# EasyEDA Pro project ProPrj_射频OPA695_2025-07-24.epro

# Schematic Schematic1
Board Name: Board1; Create Date: 2025-07-24; Page Name: P1; Project Name: 射频OPA695; Schematic Name: Schematic1; Update Date: 2025-07-24; Company: 嘉立创EDA; Page Size: A4; Version: V1.0
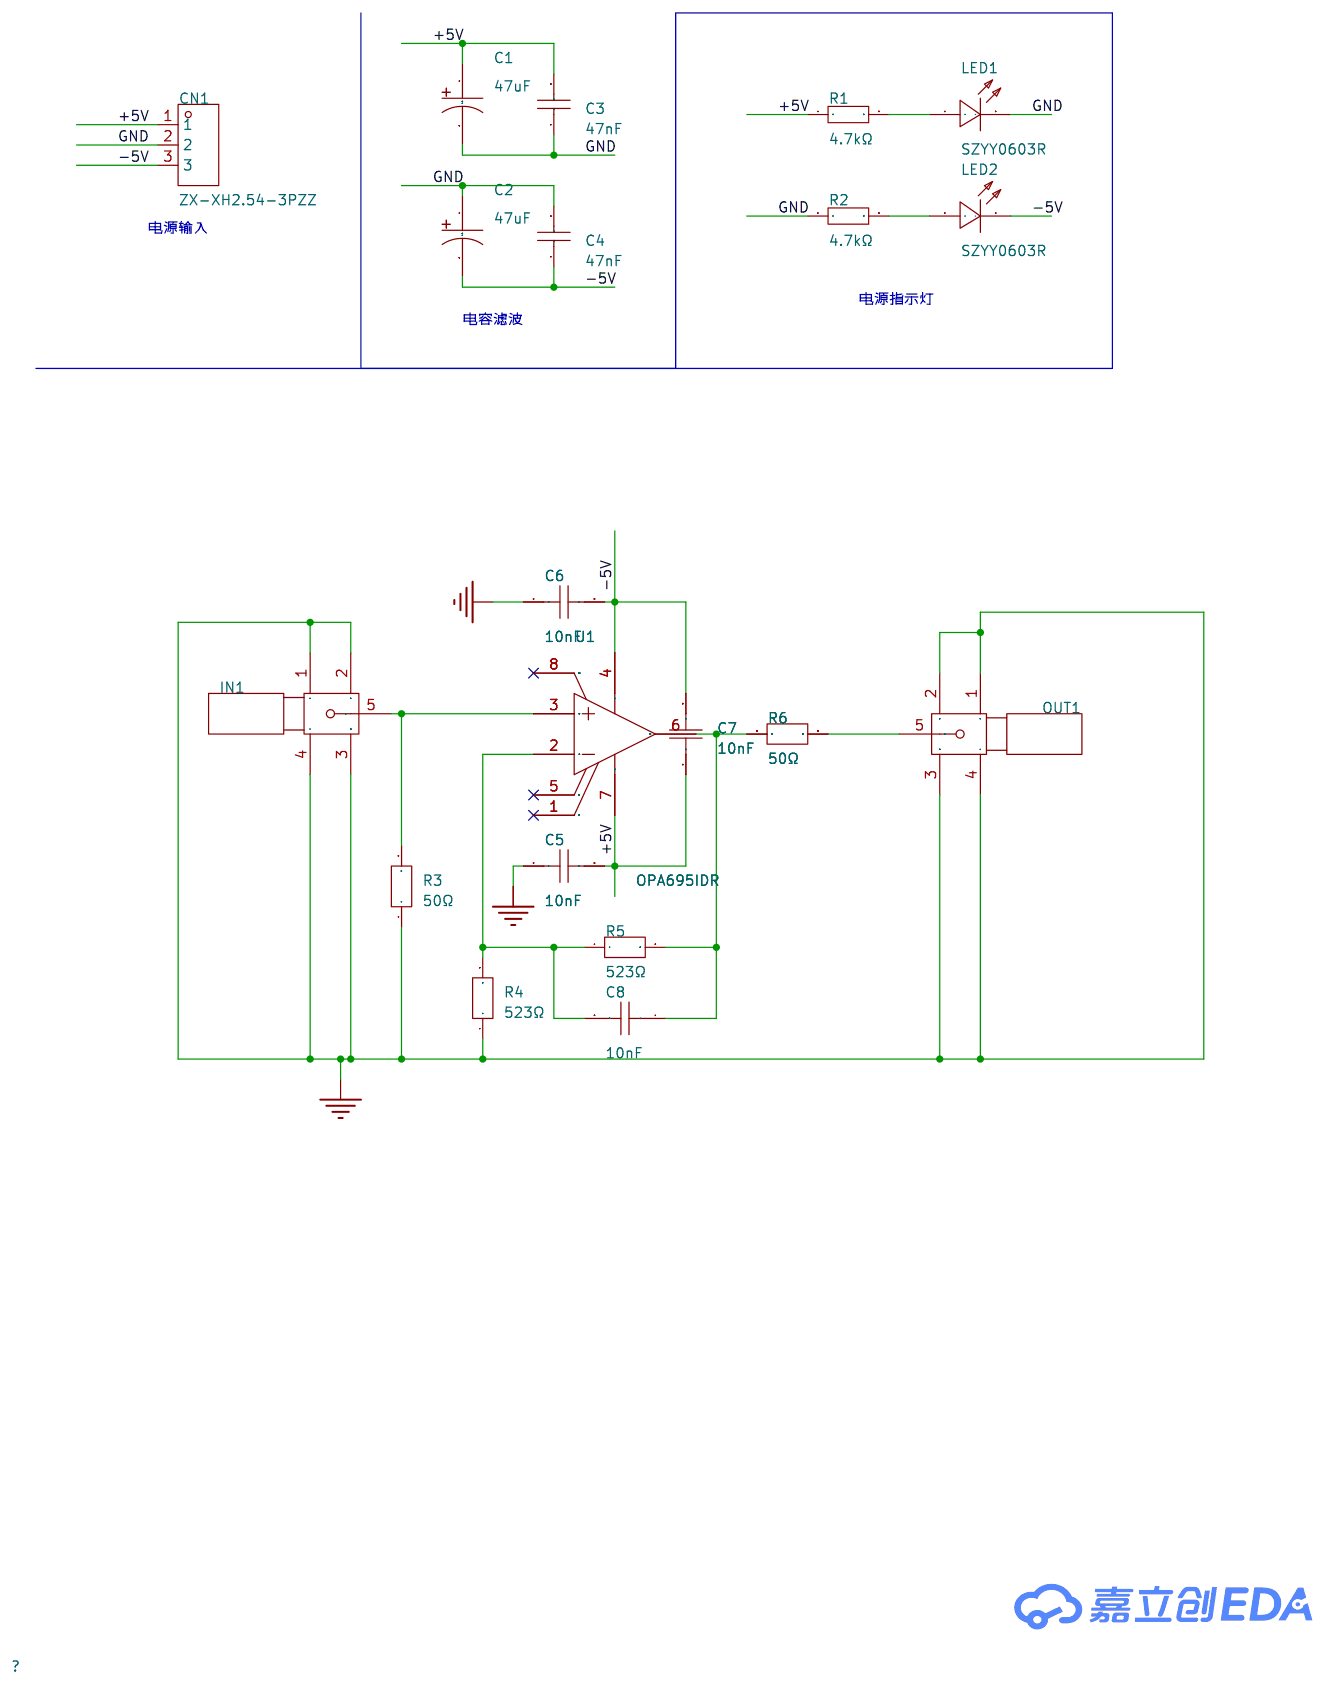
[diagram p0: schematic sheet]

## Parts
C1  47uF  [CAP-TH_BD5.0-P2.00-D0.8-FD]
C2  47uF  [CAP-TH_BD5.0-P2.00-D0.8-FD]
C3  47nF  [C0805]
C4  47nF  [C0805]
C5  10nF  [C0805]
C6  10nF  [C0805]
C7  10nF  [C0805]
C8  10nF  [C0805]
CN1  ZX-XH2.54-3PZZ  [CONN-TH_3P-P2.54_2501S-3P]
IN1  -  [SMA-SMD_BWSMA-KE-P001]
LED1  SZYY0603R  [LED0603-R-RD]
LED2  SZYY0603R  [LED0603-R-RD]
OUT1  -  [SMA-SMD_BWSMA-KE-P001]
R1  4.7kΩ  [R0805]
R2  4.7kΩ  [R0805]
R3  50Ω  [R0805]
R4  523Ω  [R0805]
R5  523Ω  [R0805]
R6  50Ω  [R0805]
U1  OPA695IDR  [SOIC-8_L5.0-W4.0-P1.27-LS6.1-BL]

## Library data of the parts
C1 C2 = NXB25V47M5*11 2.5TP: 容值:47uF;精度:±20%;额定电压:25V;纹波电流:250mA@100kHz;等效串联电阻(ESR):300mΩ@100kHz;; LCSC Part Name: 47uF ±20% 25V; Supplier Part: C371230; Manufacturer: SAMYOUNG(韩国三莹); Supplier Footprint: 插件,D5xL11mm; JLCPCB Part Class: 扩展库; Datasheet: https://atta.szlcsc.com/upload/public/pdf/source/20190227/C371244_FA85FFEFC2961227CF12E3CCE8C34A7D.pdf; Supplier: LCSC; Tolerance: ±20%; Voltage Rating: 25V; Ripple Current: 250mA@100kHz; Equivalent Series Resistance(ESR): 300mΩ@100kHz; Pin Spacing: 2mm; Diameter: 5mm; Height - Seated (Max): 11mm; Lifetime: 2000hrs@105℃; Operating Temperature: -40℃~+105℃
C3 C4 = CL21B473KBCNNNC: 容值:47nF;精度:±10%;额定电压:50V;材质(温度系数):X7R;; LCSC Part Name: 47nF ±10% 50V; Supplier Part: C53134; Manufacturer: SAMSUNG(三星); Supplier Footprint: 0805; JLCPCB Part Class: 基础库; Datasheet: https://atta.szlcsc.com/upload/public/pdf/source/20160218/1457707763339.pdf; Supplier: LCSC; Tolerance: ±10%; Voltage Rated: 50V; Temperature Coefficient: X7R
C5-C8 = CC0805KRX7R9BB103: 容值:10nF;精度:±10%;额定电压:50V;材质(温度系数):X7R;; LCSC Part Name: 10nF ±10% 50V; Supplier Part: C83170; Manufacturer: YAGEO(国巨); Supplier Footprint: 0805; JLCPCB Part Class: 扩展库; Datasheet: https://atta.szlcsc.com/upload/public/pdf/source/20170211/1486785656773.pdf; Supplier: LCSC; Tolerance: ±10%; Voltage Rated: 50V; Temperature Coefficient: X7R
CN1 = ZX-XH2.54-3PZZ: 插针结构:1x3P;间距:2.5mm;安装方式:直插;参考系列:XH;总PIN数:3P;排数:1;每排PIN数:3;行距:-;额定电流:3A;触头材质:黄铜;触头镀层:锡;工作温度范围:-25℃~+85℃;; LCSC Part Name: 1x3P 间距:2.5mm 直插 系列:XH; Supplier Part: C7429633; Manufacturer: Megastar(兆星); Supplier Footprint: 插件,P=2.5mm; JLCPCB Part Class: 扩展库; Datasheet: https://atta.szlcsc.com/upload/public/pdf/source/20230619/AE17037A2CFDBE8D9CBA775D61AD0A84.pdf; Supplier: LCSC; Pins Structure: 1x3P; Pitch: 2.5mm; Mounting Type: 直插; Reference Series: XH; Number of Pins: 3P; Number of Rows: 1; Number of PINs Per Row: 3; Rated Current: 3A; Contact Material: 黄铜; Contact Plating: 锡; Operating Temperature: -25℃~+85℃; Rated Voltage (Max): 250V; Plastic Material: PA66; Flame Retardant Rating: UL94V-0; Color: 白色; Z-Height of the Board: 7mm; X-Length of Bottom Edge on Board (Spacing Line): 10mm; Y-Width of Bottom Edge on Board: 5.9mm
IN1 OUT1 = BWSMA-KE-P001: 连接器类型:板端;接口类型:内孔;端口数量:1;接口直径:5.2mm;接口长度/高度:-;频率:-;射频系列:SMA;阻抗:50Ω;样式:偏脚;工作温度:-;; LCSC Part Name: 内孔 SMA 偏脚; Supplier Part: C496550; Manufacturer: BAT WIRELESS(蝙蝠无线); Supplier Footprint: SMD; JLCPCB Part Class: 扩展库; Datasheet: https://atta.szlcsc.com/upload/public/pdf/source/20240320/28FD502871C976DFF213ABFCF2A0ED51.pdf; Supplier: LCSC; Connector Type: 板端; Interface: 内孔; Number of Ports: 1; Interface Diameter: 5.2mm; RF Series: SMA; Impedance: 50Ω; Style: 偏脚
LED1 LED2 = SZYY0603R: 发光颜色:红色;功率:40mW;正向电流:20mA;主波长:615nm~630nm;二极管配置:-;透镜颜色:无色透明透镜;色温:-;发光角度:120°;载带方式:-;工作温度:-40℃~+85℃;; LCSC Part Name: 红灯; Supplier Part: C434419; Manufacturer: yongyu(永裕光电); Supplier Footprint: 0603; JLCPCB Part Class: 扩展库; Datasheet: https://atta.szlcsc.com/upload/public/pdf/source/20191204/C434419_0B955C1F73FF88449D9A795B6FF49070.pdf; Supplier: LCSC; Emitted Color: 红色; Power Dissipation: 40mW; Forward Current: 20mA; Dominant Wavelength: 615nm~630nm; Peak Wavelength: 645nm; Lens Color: 无色透明透镜; Viewing Angle: 120°; Operating Temperature: -40℃~+85℃
R1 R2 = 0805W8F4701T5E: 电阻类型:厚膜电阻;阻值:4.7kΩ;精度:±1%;功率:125mW;最大工作电压:150V;温度系数:±100ppm/℃;; LCSC Part Name: 4.7kΩ ±1% 125mW 厚膜电阻; Supplier Part: C17673; Manufacturer: UNI-ROYAL(厚声); Supplier Footprint: 0805; JLCPCB Part Class: 基础库; Datasheet: https://atta.szlcsc.com/upload/public/pdf/source/20200306/C422600_1E6D84923E4A46A82E41ADD87F860B5C.pdf; Supplier: LCSC; Type: 厚膜电阻; Tolerance: ±1%; Power(Watts): 125mW; Overload Voltage (Max): 150V; Temperature Coefficient: ±100ppm/℃; Operating Temperature Range: -55℃~+155℃
R3 R6 = ARG05FTC0500: 电阻类型:薄膜电阻;阻值:50Ω;精度:±1%;功率:125mW;最大工作电压:150V;温度系数:±25ppm/℃;; LCSC Part Name: 薄膜电阻 50Ω ±1% 125mW; Supplier Part: C2828866; Manufacturer: Viking(光颉); Supplier Footprint: 0805; JLCPCB Part Class: 扩展库; Datasheet: https://atta.szlcsc.com/upload/public/pdf/source/20211009/C2828883_CAE7D170B8B230FC4A048BDC7B3A81FC.pdf; Supplier: LCSC; Type: 薄膜电阻; Tolerance: ±1%; Power(Watts): 125mW; Overload Voltage (Max): 150V; Temperature Coefficient: ±25ppm/℃; Operating Temperature Range: -55℃~+155℃
R4 R5 = PTFR0805B523RP9: 电阻类型:薄膜电阻;阻值:523Ω;精度:±0.1%;功率:130mW;工作电压:150V;温度系数:±25ppm/℃;; LCSC Part Name: 薄膜电阻 523Ω ±0.1% 130mW; Supplier Part: C2849265; Manufacturer: RESI(开步睿思); Supplier Footprint: 0805; JLCPCB Part Class: 扩展库; Datasheet: https://atta.szlcsc.com/upload/public/pdf/source/20240506/11BDC7478D84177AC2A5326A65B6EB29.pdf; Supplier: LCSC; Type: 薄膜电阻; Tolerance: ±0.1%; Power(Watts): 130mW; Voltage-Supply(Max): 150V; Temperature Coefficient: ±25ppm/℃; Operating Temperature: -55℃~+155℃
U1 = OPA695IDR: 放大器数:单路;增益带宽积(GBP):-;压摆率(SR):4.3V/ns;输入偏置电流(Ib):20uA;; Supplier Part: C1848175; Manufacturer: TI(德州仪器); Supplier Footprint: SOIC-8; JLCPCB Part Class: 扩展库; Datasheet: https://www.ti.com/cn/lit/gpn/opa695; Supplier: LCSC; Number of Channels: 单路; Slew Rate: 4.3V/ns; Ib - Input Bias Current: 20uA; Output Current: 120mA; Operating Temperature: -40℃~+85℃

## Nets
+5V: C1.1 C3.2 C5.2 C7.1 CN1.1 R1.1 U1.7(+VS)
-5V: C2.2 C4.1 C6.2 C7.2 CN1.3 LED2.2(-) U1.4(-VS)
GND: C1.2 C2.1 C3.1 C4.2 C5.1 C6.1 CN1.2 IN1.1 IN1.2 IN1.3 IN1.4 LED1.2(-) OUT1.1 OUT1.2 OUT1.3 OUT1.4 R2.1 R3.1 R4.1
$1N805: LED1.1(+) R1.2
$1N814: LED2.1(+) R2.2
Net-(C8-1): C8.1 R5.2 R6.1 U1.6(Output)
Net-(C8-2): C8.2 R4.2 R5.1 U1.2(-IN)
Net-(IN1-5): IN1.5 R3.2 U1.3(+IN)
Net-(OUT1-5): OUT1.5 R6.2

Not connected (* = marked no-connect by the designer): U1 1(NC)* 5(NC)* 8(DIS#)*

## Notes on the sheet
- 电源输入
- 电源指示灯
- 电容滤波

# Board PCB1
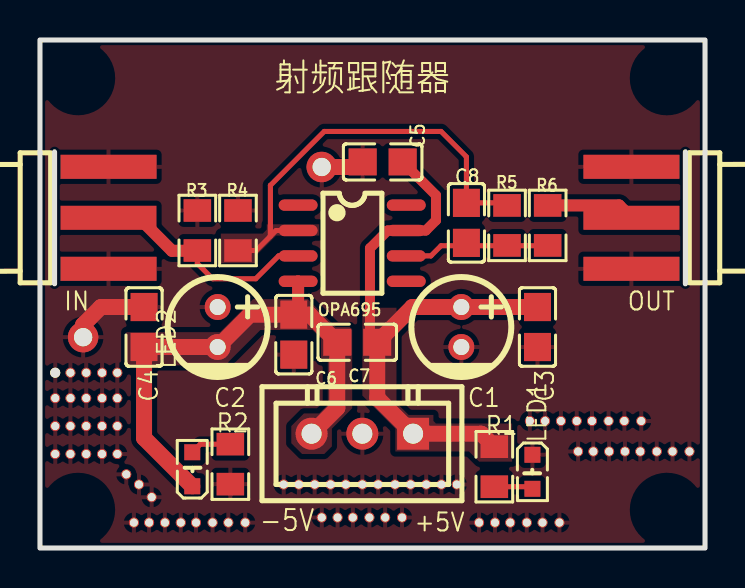
[diagram p1: board, top side]
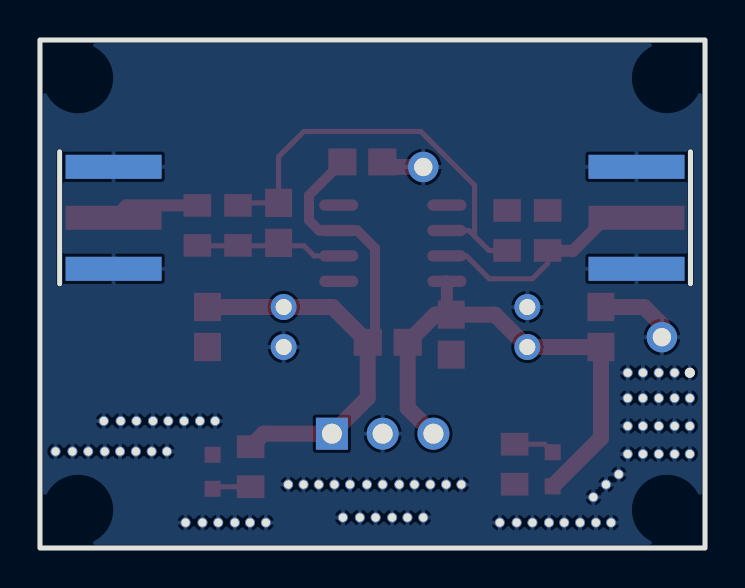
[diagram p2: board, bottom side, seen from below]

Outline 33.27 x 25.4 mm; copper layers: Top Layer, Bottom Layer. Coordinates in mm from the lower left corner of the outline.
Outline path: rectangle 0,25.4 33.27,0
Stack: Top Layer 0.035mm / Dielectric1 1.51mm FR4 er 4.5 / Bottom Layer 0.035mm

## Design rules (mm)
template: JLCPCB Capability(Two Layers Board)
spacing copperThickness1oz (default): track to track 0.102, other pairs 0.152 to 0.3
spacing copperThickness2oz: track to track 0.203, other pairs 0.152 to 0.3
track width copperThickness1oz (default): min 0.127, default 0.254, max 2.54
track width copperThickness2oz: min 0.203, default 0.254, max 2.54
differential pair differentialPair (default): width min 0.127, default 0.254, max 2.54; gap min 0.152, default 0.152
via viaSize (default): diameter min 0.5, default 0.61, max 10; hole min 0.3, default 0.305, max 6.3

## Placement (name value [footprint] x y rotation side)
+5V  ZX-XH2.54-3PZZ  [CONN-TH_3P-P2.54_2501S-3P]  16.13 5.72 180 top
C1  47uF  [CAP-TH_BD5.0-P2.00-D0.8-FD]  21.08 11.05 270 top
C2  47uF  [CAP-TH_BD5.0-P2.00-D0.8-FD]  8.89 11.05 270 top
C3  47nF  [C0805]  24.89 11.05 90 top
C4  47nF  [C0805]  5.21 11.05 90 top
C5  10nF  [C0805]  17.14 19.3 0 top
C6  10nF  [C0805]  12.7 10.67 90 top
C7  10nF  [C0805]  15.88 10.29 180 top
C8  10nF  [C0805]  21.34 16.26 90 top
IN  -  [SMA-SMD_BWSMA-KE-P001]  3.43 16.51 180 top
LED1  SZYY0603R  [LED0603-R-RD]  24.64 3.81 270 top
LED2  SZYY0603R  [LED0603-R-RD]  7.62 3.94 90 top
NOREF  -  [Pad_e430]  29.27 4.83 0 top
NOREF#2  -  [Pad_e456]  22.76 1.27 0 top
NOREF#3  -  [Pad_e433]  31.65 4.83 0 top
NOREF#4  -  [Pad_e446]  16.48 1.52 0 top
NOREF#5  -  [Pad_e338]  2.31 7.49 0 top
NOREF#6  -  [Pad_e386]  17.76 3.17 0 top
NOREF#7  -  [Pad_e428]  27.69 4.83 0 top
NOREF#8  -  [Pad_e340]  3.87 7.49 0 top
NOREF#9  -  [Pad_e447]  17.27 1.52 0 top
NOREF#10  -  [Pad_e349]  3.11 6.1 0 top
NOREF#11  -  [Pad_e460]  25.99 1.27 0 top
NOREF#12  -  [Pad_e382]  14.54 3.17 0 top
NOREF#13  -  [Pad_e458]  24.36 1.27 0 top
NOREF#14  -  [Pad_e358]  6.25 1.27 0 top
NOREF#15  -  [Pad_e408]  28.45 6.35 0 top
NOREF#16  -  [Pad_e351]  0.76 4.7 0 top
NOREF#17  -  [Pad_e427]  26.92 4.83 0 top
NOREF#18  -  [Pad_e317]  1.52 8.76 0 top
NOREF#19  -  [Pad_e404]  25.27 6.35 0 top
NOREF#20  -  [Pad_e434]  32.5 4.83 0 top
NOREF#21  -  [Pad_e339]  3.11 7.49 0 top
NOREF#22  -  [Pad_e347]  1.52 6.1 0 top
NOREF#23  -  [Pad_e374]  10.27 1.27 0 top
NOREF#24  -  [Pad_e319]  3.11 8.76 0 top
NOREF#25  -  [Pad_e353]  2.31 4.7 0 top
NOREF#26  -  [Pad_e357]  5.46 1.27 0 top
NOREF#27  -  [Pad_e448]  18.12 1.52 0 top
NOREF#28  -  [Pad_e410]  30.08 6.35 0 top
NOREF#29  -  [Pad_e383]  15.3 3.17 0 top
NOREF#30  -  [Pad_e436]  19.32 3.17 0 top
NOREF#31  -  [Pad_e337]  1.52 7.49 0 top
NOREF#32  -  [Pad_e372]  8.64 1.27 0 top
NOREF#33  -  [Pad_e336]  0.76 7.49 0 top
NOREF#34  -  [Pad_e444]  14.89 1.52 0 top
NOREF#35  -  [Pad_e366]  4.32 3.68 0 top
NOREF#36  -  [Pad_e373]  9.42 1.27 0 top
NOREF#37  -  [Pad_e405]  26.06 6.35 0 top
NOREF#38  -  [Pad_e316]  0.76 8.76 0 top
NOREF#39  -  [Pad_e104]  2.16 10.54 0 top
NOREF#40  -  [Pad_e459]  25.14 1.27 0 top
NOREF#41  -  [Pad_e360]  7.81 1.27 0 top
NOREF#42  -  [Pad_e355]  3.87 4.7 0 top
NOREF#43  -  [Pad_e437]  20.09 3.17 0 top
NOREF#44  -  [Pad_e455]  21.97 1.27 0 top
NOREF#45  -  [Pad_e435]  18.54 3.17 0 top
NOREF#46  -  [Pad_e407]  27.62 6.35 0 top
NOREF#47  -  [Pad_e438]  20.85 3.17 0 top
NOREF#48  -  [Pad_e457]  23.53 1.27 0 top
NOREF#49  -  [Pad_e348]  2.31 6.1 0 top
NOREF#50  -  [Pad_e403]  24.51 6.35 0 top
NOREF#51  -  [Pad_e385]  16.92 3.17 0 top
NOREF#52  -  [Pad_e381]  13.74 3.17 0 top
NOREF#53  -  [Pad_e320]  3.87 8.76 0 top
NOREF#54  -  [Pad_e431]  30.03 4.83 0 top
NOREF#55  -  [Pad_e409]  29.24 6.35 0 top
NOREF#56  -  [Pad_e445]  15.65 1.52 0 top
NOREF#57  -  [Pad_e356]  4.7 1.27 0 top
NOREF#58  -  [Pad_e359]  7.04 1.27 0 top
NOREF#59  -  [Pad_e429]  28.48 4.83 0 top
NOREF#60  -  [Pad_e380]  12.95 3.17 0 top
NOREF#61  -  [Pad_e432]  30.86 4.83 0 top
NOREF#62  -  [Pad_e379]  12.19 3.17 0 top
NOREF#63  -  [Pad_e318]  2.31 8.76 0 top
NOREF#64  -  [Pad_e384]  16.13 3.17 0 top
NOREF#65  -  [Pad_e212]  14.1 19.05 0 top
NOREF#66  -  [Pad_e354]  3.11 4.7 0 top
NOREF#67  -  [Pad_e367]  4.95 3.17 0 top
NOREF#68  -  [Pad_e443]  14.1 1.52 0 top
NOREF#69  -  [Pad_e350]  3.87 6.1 0 top
NOREF#70  -  [Pad_e406]  26.86 6.35 0 top
NOREF#71  -  [Pad_e346]  0.76 6.1 0 top
NOREF#72  -  [Pad_e352]  1.52 4.7 0 top
NOREF#73  -  [Pad_e368]  5.59 2.54 0 top
OPA695  OPA695IDR  [SOIC-8_L5.0-W4.0-P1.27-LS6.1-BL]  15.62 15.24 270 top
OUT  -  [SMA-SMD_BWSMA-KE-P001]  29.59 16.51 0 top
R1  4.7kΩ  [R0805]  22.73 4.06 270 top
R2  4.7kΩ  [R0805]  9.52 4.19 90 top
R3  50Ω  [R0805]  7.87 15.88 270 top
R4  523Ω  [R0805]  9.91 15.88 270 top
R5  523Ω  [R0805]  23.37 16.13 270 top
R6  50Ω  [R0805]  25.4 16.13 90 top

## Footprints (pads in the part's own frame, mm; a bottom-side part is the same pattern mirrored in y, then rotated)
C0805
  rect 1.41x1.35 smd: 1(-1,0) 2(1,0)
CAP-TH_BD5.0-P2.00-D0.8-FD
  round 1.3 hole 0.8: 1(-1,0) 2(1,0)
CONN-TH_3P-P2.54_2501S-3P
  rect 1.6x1.6 hole 1: 1(-2.54,0)
  round 1.6 hole 1: 2(0,0) 3(2.54,0)
LED0603-R-RD
  rect 0.8x0.8 smd: 1(0.851,0) 2(-0.851,0)
Pad_e104
  round 1.524 hole 0.914: 1(0,0)
Pad_e212
  round 1.524 hole 0.914: 1(0,0)
Pad_e316
  round 0.5 hole 0.914x0.4: 1(0,0)
Pad_e317
  round 0.5 hole 0.4: 1(0,0)
Pad_e318
  round 0.5 hole 0.4: 1(0,0)
Pad_e319
  round 0.5 hole 0.4: 1(0,0)
Pad_e320
  round 0.5 hole 0.4: 1(0,0)
Pad_e336
  round 0.5 hole 0.4: 1(0,0)
Pad_e337
  round 0.5 hole 0.4: 1(0,0)
Pad_e338
  round 0.5 hole 0.4: 1(0,0)
Pad_e339
  round 0.5 hole 0.4: 1(0,0)
Pad_e340
  round 0.5 hole 0.4: 1(0,0)
Pad_e346
  round 0.5 hole 0.4: 1(0,0)
Pad_e347
  round 0.5 hole 0.4: 1(0,0)
Pad_e348
  round 0.5 hole 0.4: 1(0,0)
Pad_e349
  round 0.5 hole 0.4: 1(0,0)
Pad_e350
  round 0.5 hole 0.4: 1(0,0)
Pad_e351
  round 0.5 hole 0.4: 1(0,0)
Pad_e352
  round 0.5 hole 0.4: 1(0,0)
Pad_e353
  round 0.5 hole 0.4: 1(0,0)
Pad_e354
  round 0.5 hole 0.4: 1(0,0)
Pad_e355
  round 0.5 hole 0.4: 1(0,0)
Pad_e356
  round 0.5 hole 0.4: 1(0,0)
Pad_e357
  round 0.5 hole 0.4: 1(0,0)
Pad_e358
  round 0.5 hole 0.4: 1(0,0)
Pad_e359
  round 0.5 hole 0.4: 1(0,0)
Pad_e360
  round 0.5 hole 0.4: 1(0,0)
Pad_e366
  round 0.5 hole 0.4: 1(0,0)
Pad_e367
  round 0.5 hole 0.4: 1(0,0)
Pad_e368
  round 0.5 hole 0.4: 1(0,0)
Pad_e372
  round 0.5 hole 0.4: 1(0,0)
Pad_e373
  round 0.5 hole 0.4: 1(0,0)
Pad_e374
  round 0.5 hole 0.4: 1(0,0)
Pad_e379
  round 0.5 hole 0.4: 1(0,0)
Pad_e380
  round 0.5 hole 0.4: 1(0,0)
Pad_e381
  round 0.5 hole 0.4: 1(0,0)
Pad_e382
  round 0.5 hole 0.4: 1(0,0)
Pad_e383
  round 0.5 hole 0.4: 1(0,0)
Pad_e384
  round 0.5 hole 0.4: 1(0,0)
Pad_e385
  round 0.5 hole 0.4: 1(0,0)
Pad_e386
  round 0.5 hole 0.4: 1(0,0)
Pad_e403
  round 0.5 hole 0.4: 1(0,0)
Pad_e404
  round 0.5 hole 0.4: 1(0,0)
Pad_e405
  round 0.5 hole 0.4: 1(0,0)
Pad_e406
  round 0.5 hole 0.4: 1(0,0)
Pad_e407
  round 0.5 hole 0.4: 1(0,0)
Pad_e408
  round 0.5 hole 0.4: 1(0,0)
Pad_e409
  round 0.5 hole 0.4: 1(0,0)
Pad_e410
  round 0.5 hole 0.4: 1(0,0)
Pad_e427
  round 0.5 hole 0.4: 1(0,0)
Pad_e428
  round 0.5 hole 0.4: 1(0,0)
Pad_e429
  round 0.5 hole 0.4: 1(0,0)
Pad_e430
  round 0.5 hole 0.4: 1(0,0)
Pad_e431
  round 0.5 hole 0.4: 1(0,0)
Pad_e432
  round 0.5 hole 0.4: 1(0,0)
Pad_e433
  round 0.5 hole 0.4: 1(0,0)
Pad_e434
  round 0.5 hole 0.4: 1(0,0)
Pad_e435
  round 0.5 hole 0.4: 1(0,0)
Pad_e436
  round 0.5 hole 0.4: 1(0,0)
Pad_e437
  round 0.5 hole 0.4: 1(0,0)
Pad_e438
  round 0.5 hole 0.4: 1(0,0)
Pad_e443
  round 0.5 hole 0.4: 1(0,0)
Pad_e444
  round 0.5 hole 0.4: 1(0,0)
Pad_e445
  round 0.5 hole 0.4: 1(0,0)
Pad_e446
  round 0.5 hole 0.4: 1(0,0)
Pad_e447
  round 0.5 hole 0.4: 1(0,0)
Pad_e448
  round 0.5 hole 0.4: 1(0,0)
Pad_e455
  round 0.5 hole 0.4: 1(0,0)
Pad_e456
  round 0.5 hole 0.4: 1(0,0)
Pad_e457
  round 0.5 hole 0.4: 1(0,0)
Pad_e458
  round 0.5 hole 0.4: 1(0,0)
Pad_e459
  round 0.5 hole 0.4: 1(0,0)
Pad_e460
  round 0.5 hole 0.4: 1(0,0)
R0805
  rect 1.133x1.377 smd: 1(-1,0) 2(1,0)
SMA-SMD_BWSMA-KE-P001
  rect 4.8x1.2 smd: 1(0,-2.55) 2(0,2.55) 5(0,0)
  rect 4.8x1.2 smd far side: 3(0,2.55) 4(0,-2.55)
SOIC-8_L5.0-W4.0-P1.27-LS6.1-BL
  oval 0.569x1.95 smd: 1(-1.905,-2.705) 2(-0.635,-2.705) 3(0.635,-2.705) 4(1.905,-2.705) 5(1.905,2.705) 6(0.635,2.705) 7(-0.635,2.705) 8(-1.905,2.705)

## Nets
+5V: +5V.1 C1.1 C3.2 C5.2 C7.1 OPA695.7 R1.1
-5V: +5V.3 C2.2 C4.1 C6.2 C7.2 LED2.2 OPA695.4
GND: +5V.2 C1.2 C2.1 C3.1 C4.2 C5.1 C6.1 IN.1 IN.2 IN.3 IN.4 LED1.2 NOREF.1 NOREF#2.1 NOREF#3.1 NOREF#4.1 NOREF#5.1 NOREF#6.1 NOREF#7.1 NOREF#8.1 NOREF#9.1 NOREF#10.1 NOREF#11.1 NOREF#12.1 NOREF#13.1 NOREF#14.1 NOREF#15.1 NOREF#16.1 NOREF#17.1 NOREF#18.1 NOREF#19.1 NOREF#20.1 NOREF#21.1 NOREF#22.1 NOREF#23.1 NOREF#24.1 NOREF#25.1 NOREF#26.1 NOREF#27.1 NOREF#28.1 NOREF#29.1 NOREF#30.1 NOREF#31.1 NOREF#32.1 NOREF#33.1 NOREF#34.1 NOREF#35.1 NOREF#36.1 NOREF#37.1 NOREF#38.1 NOREF#39.1 NOREF#40.1 NOREF#41.1 NOREF#42.1 NOREF#43.1 NOREF#44.1 NOREF#45.1 NOREF#46.1 NOREF#47.1 NOREF#48.1 NOREF#49.1 NOREF#50.1 NOREF#51.1 NOREF#52.1 NOREF#53.1 NOREF#54.1 NOREF#55.1 NOREF#56.1 NOREF#57.1 NOREF#58.1 NOREF#59.1 NOREF#60.1 NOREF#61.1 NOREF#62.1 NOREF#63.1 NOREF#64.1 NOREF#65.1 NOREF#66.1 NOREF#67.1 NOREF#68.1 NOREF#69.1 NOREF#70.1 NOREF#71.1 NOREF#72.1 NOREF#73.1 OUT.1 OUT.2 OUT.3 OUT.4 R2.1 R3.1 R4.1
$1N805: LED1.1 R1.2
$1N814: LED2.1 R2.2
$1N897: IN.5 OPA695.3 R3.2
$1N1090: C8.1 OPA695.6 R5.2 R6.1
$1N1208: C8.2 OPA695.2 R4.2 R5.1
$1N2311: OUT.5 R6.2

Pads without a net: OPA695 1 5 8

## Routing (per net, layer and track width the routed paths; a pad name or vN(x,y) marks a point on that pad's centre or on a via; arc(x,y) is an arc through that point)
+5V: length 30.7
  Top Layer w0.5: C5.2 19.81,17.64 19.81,16.38 19.3,15.88 OPA695.7 17.4,15.88 16.51,14.99 16.51,10.65 C7.1
  Top Layer w0.8: R1.1 22.08,5.72 +5V.1 16.88,7.51 C7.1 18.64,12.05 C1.1 C3.2
-5V: length 25.7
  Top Layer w0.6: 12.92,13.33 12.92,11.88 C6.2
  Top Layer w0.8: LED2.2 5.21,5.5 C4.1 C2.2 10.51,11.67 C6.2 13.49,11.67 C7.2 14.88,7 +5V.3
GND: length 6.2
  Top Layer w0.8: NOREF#65.1 15.89,19.05 C5.1 ; NOREF#39.1 2.16,11.16 3.05,12.05 C4.2
$1N805: length 1.9
  Top Layer w0.254: LED1.1 24.53,3.06 R1.2
$1N814: length 2.1
  Top Layer w0.254: R2.2 8.02,5.19 LED2.1
$1N897: length 11.6
  Top Layer w0.254: R3.2 7.87,14.22 8.64,13.46 10.79,13.46 11.94,14.61 12.92,14.61
  Top Layer w0.6: R3.2 7.86,14.86 6.6,14.86 4.95,16.51 IN.5
$1N1090: length 7.3
  Top Layer w0.254: OPA695.6 19.56,14.61 20.07,15.11 25.38,15.11 R6.1
$1N1208: length 21.8
  Top Layer w0.254: R5.1 23.24,17.26 C8.2 21.34,19.56 20.07,20.83 14.22,20.83 11.53,18.13 11.53,15.59 ; 11.53,15.59 11.81,15.88 12.92,15.88 ; 11.53,15.59 10.81,14.88 R4.2
$1N2311: length 4.4
  Top Layer w0.6: OUT.5 28.97,17.13 R6.2

## Copper pours and planes (outline as drawn; the poured copper is in the pictures)
+5V on Top Layer: 16.13,12.01 23.62,12.01 23.62,4.32 16.13,4.32
-5V on Top Layer: 4.32,12.45 15.62,12.45 15.62,4.7 4.32,4.7
GND on Top Layer: -0.64,26.29 34.29,26.29 34.29,-1.14 -0.64,-1.14
GND on Bottom Layer: -1.52,27.31 34.8,27.31 34.8,-2.03 -1.52,-2.03
$1N1208 on Top Layer: 9.05,16.19 13.97,16.19 13.97,14.24 9.05,14.24

## Text on the board
Top Silkscreen Layer: -5V | 射频跟随器
